# Altium schematic sheet EMG_connectors_and_filters_CH_5_8.SchDoc: EMG_connectors_and_filters_CH_5_8
size B; Organization: Myomo; Address1: 137 PORTLAND STREET, 4TH FLOOR; Address2: BOSTON, MA 02114; Address3: USA; SheetNumber: 6
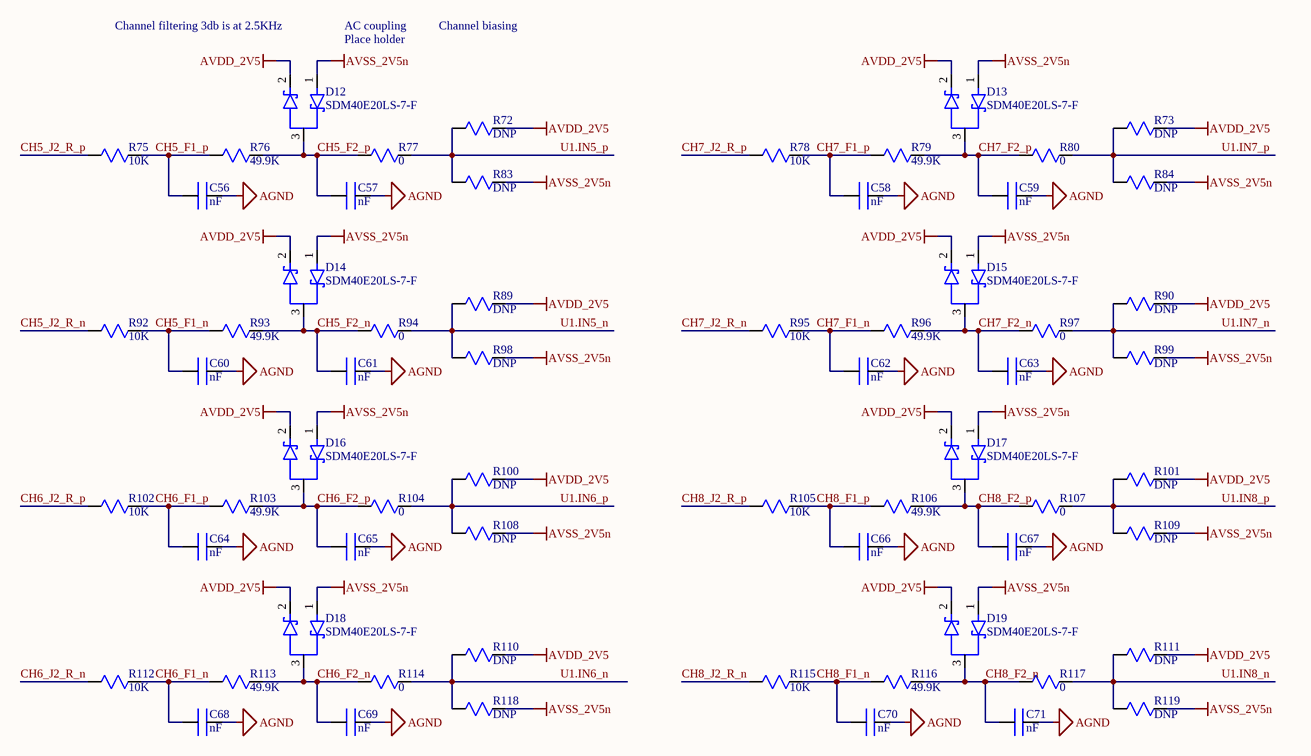
[diagram p0: EMG_connectors_and_filters_CH_5_8.SchDoc]

## Parts
C56  nF  [0402]
C57  nF  [0402]
C58  nF  [0402]
C59  nF  [0402]
C60  nF  [0402]
C61  nF  [0402]
C62  nF  [0402]
C63  nF  [0402]
C64  nF  [0402]
C65  nF  [0402]
C66  nF  [0402]
C67  nF  [0402]
C68  nF  [0402]
C69  nF  [0402]
C70  nF  [0402]
C71  nF  [0402]
D12  SDM40E20LS-7-F  [D_SCHOTT_0.31mV_400mA]
D13  SDM40E20LS-7-F  [D_SCHOTT_0.31mV_400mA]
D14  SDM40E20LS-7-F  [D_SCHOTT_0.31mV_400mA]
D15  SDM40E20LS-7-F  [D_SCHOTT_0.31mV_400mA]
D16  SDM40E20LS-7-F  [D_SCHOTT_0.31mV_400mA]
D17  SDM40E20LS-7-F  [D_SCHOTT_0.31mV_400mA]
D18  SDM40E20LS-7-F  [D_SCHOTT_0.31mV_400mA]
D19  SDM40E20LS-7-F  [D_SCHOTT_0.31mV_400mA]
R72  DNP  [0402]  (no BOM)
R73  DNP  [0402]  (no BOM)
R75  10K  [0402]
R76  49.9K  [0402]
R77  0  [0402]
R78  10K  [0402]
R79  49.9K  [0402]
R80  0  [0402]
R83  DNP  [0402]  (no BOM)
R84  DNP  [0402]  (no BOM)
R89  DNP  [0402]  (no BOM)
R90  DNP  [0402]  (no BOM)
R92  10K  [0402]
R93  49.9K  [0402]
R94  0  [0402]
R95  10K  [0402]
R96  49.9K  [0402]
R97  0  [0402]
R98  DNP  [0402]  (no BOM)
R99  DNP  [0402]  (no BOM)
R100  DNP  [0402]  (no BOM)
R101  DNP  [0402]  (no BOM)
R102  10K  [0402]
R103  49.9K  [0402]
R104  0  [0402]
R105  10K  [0402]
R106  49.9K  [0402]
R107  0  [0402]
R108  DNP  [0402]  (no BOM)
R109  DNP  [0402]  (no BOM)
R110  DNP  [0402]  (no BOM)
R111  DNP  [0402]  (no BOM)
R112  10K  [0402]
R113  49.9K  [0402]
R114  0  [0402]
R115  10K  [0402]
R116  49.9K  [0402]
R117  0  [0402]
R118  DNP  [0402]  (no BOM)
R119  DNP  [0402]  (no BOM)

## Nets
AGND: C56.2 C57.2 C58.2 C59.2 C60.2 C61.2 C62.2 C63.2 C64.2 C65.2 C66.2 C67.2 C68.2 C69.2 C70.2 C71.2
AVDD_2V5: D12.2(A2) D13.2(A2) D14.2(A2) D15.2(A2) D16.2(A2) D17.2(A2) D18.2(A2) D19.2(A2) R72.2 R73.2 R89.2 R90.2 R100.2 R101.2 R110.2 R111.2
AVSS_2V5n: D12.1(A1) D13.1(A1) D14.1(A1) D15.1(A1) D16.1(A1) D17.1(A1) D18.1(A1) D19.1(A1) R83.2 R84.2 R98.2 R99.2 R108.2 R109.2 R118.2 R119.2
CH5_F1_n: C60.1 R92.2 R93.1
CH5_F1_p: C56.1 R75.2 R76.1
CH5_F2_n: C61.1 D14.3(K) R93.2 R94.1
CH5_F2_p: C57.1 D12.3(K) R76.2 R77.1
CH5_J2_R_n: R92.1
CH5_J2_R_p: R75.1
CH6_F1_n: C68.1 R112.2 R113.1
CH6_F1_p: C64.1 R102.2 R103.1
CH6_F2_n: C69.1 D18.3(K) R113.2 R114.1
CH6_F2_p: C65.1 D16.3(K) R103.2 R104.1
CH6_J2_R_n: R112.1
CH6_J2_R_p: R102.1
CH7_F1_n: C62.1 R95.2 R96.1
CH7_F1_p: C58.1 R78.2 R79.1
CH7_F2_n: C63.1 D15.3(K) R96.2 R97.1
CH7_F2_p: C59.1 D13.3(K) R79.2 R80.1
CH7_J2_R_n: R95.1
CH7_J2_R_p: R78.1
CH8_F1_n: C70.1 R115.2 R116.1
CH8_F1_p: C66.1 R105.2 R106.1
CH8_F2_n: C71.1 D19.3(K) R116.2 R117.1
CH8_F2_p: C67.1 D17.3(K) R106.2 R107.1
CH8_J2_R_n: R115.1
CH8_J2_R_p: R105.1
U1.IN5_n: R89.1 R94.2 R98.1
U1.IN5_p: R72.1 R77.2 R83.1
U1.IN6_n: R110.1 R114.2 R118.1
U1.IN6_p: R100.1 R104.2 R108.1
U1.IN7_n: R90.1 R97.2 R99.1
U1.IN7_p: R73.1 R80.2 R84.1
U1.IN8_n: R111.1 R117.2 R119.1
U1.IN8_p: R101.1 R107.2 R109.1

## Notes on the sheet
- Channel filtering 3db is at 2.5KHz
- AC coupling
- (near D12) Place holder
- Channel biasing
- TITLE:
- NAME
- DATE
- PCA REVISION:
- PCA NAME:
- APPROVED BY:
- DESIGNED BY:
- PCA NUMBER:
- DATE:
- TIME:
- DOCUMENT SIZE:
- SHEET:
- OF
- B
- PROPRIETARY AND CONFIDENTIAL
  THIS DOCUMENT AND THE DATA CONTAINED HEREIN OR HEREWITH IS NOT TO BE REPRODUCED, USED, OR DISCLOSED, IN WHOLE OR IN PART, WITHOUT THE PERMISSION OF
  MYOMO, INC.

## Library data of the parts
C56-C71 = C_0402_CER_1nF_50V_X7R: CAP CER 1000PF 50V X7R 0402; MFG: Samsung; MFGPN: CL05B102KB5NNNC; Myomo PN: 201-0019
D12-D19 = D_SCHOTT_0.31mV_400mA: DIODE ARR SCHOTT 20V 400MA SOT23; MFG: Diodes Incorporated; Myomo PN: 203-0006; MFGPN: SDM40E20LS-7-F
R72 R73 R83 R84 R89 R90 R98-R101 R108-R111 R118 R119 = R_0402_DNP: RES 0402 DNP
R75 R78 R92 R95 R102 R105 R112 R115 = R_0402_10K_1%_1/10W: RES SMD 10K OHM 1% 1/10W 0402; MFG: Panasonic; MFGPN: ERJ-2RKF1002X; Myomo PN: 200-0021
R76 R79 R93 R96 R103 R106 R113 R116 = R_0402_49.9K_1%_1/10W: RES SMD 49.9 OHM 1% 1/10W 0402; MFG: Panasonic; MFGPN: ERJ-2RKF49R9X; Myomo PN: 200-0027
R77 R80 R94 R97 R104 R107 R114 R117 = R_0402_0: RES 0 OHM JUMPER 1/10W 0402; MFG: YAGEO; MFGPN: RC0402FR-070RL; Myomo PN: 200-0018